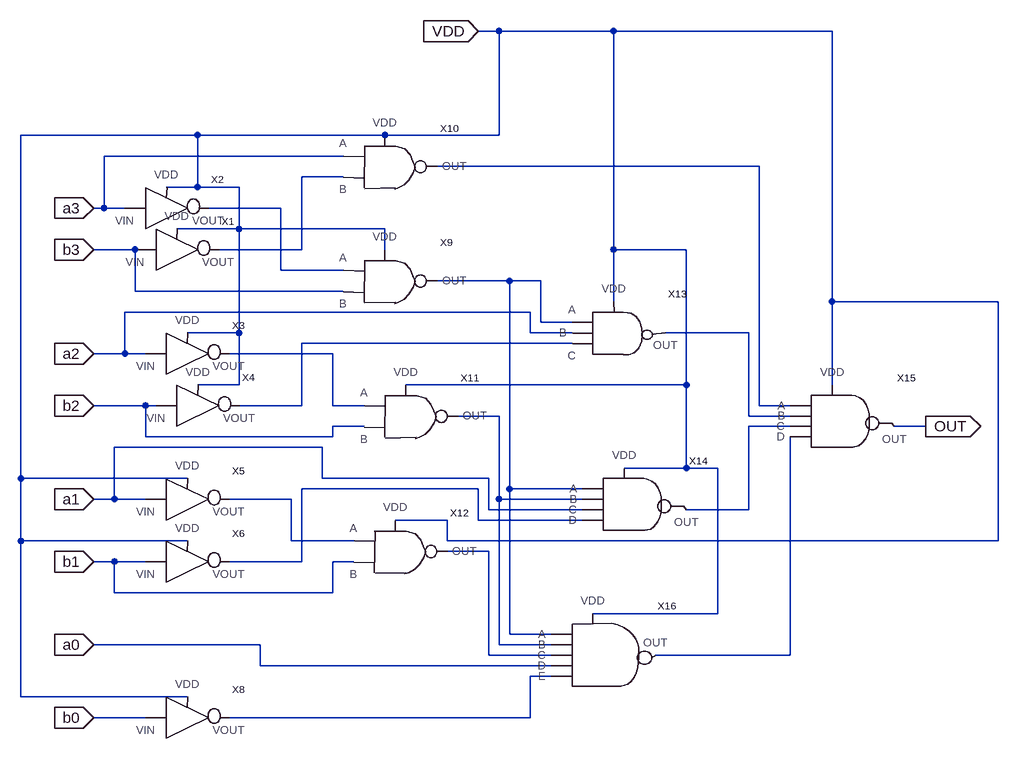
[diagram p0: schematic comparator.asc]
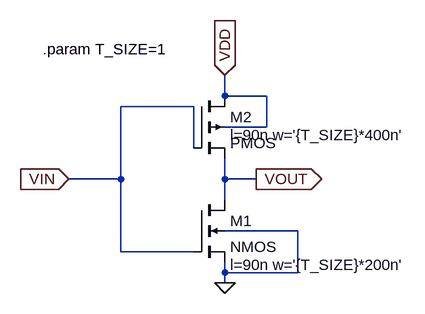
[diagram p1: sub-circuit inverter.asc]
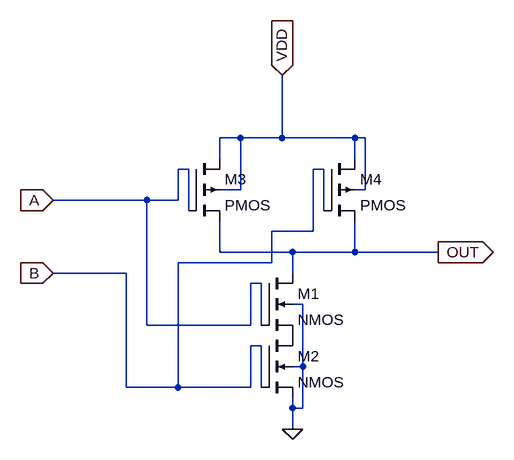
[diagram p2: sub-circuit nand.asc]
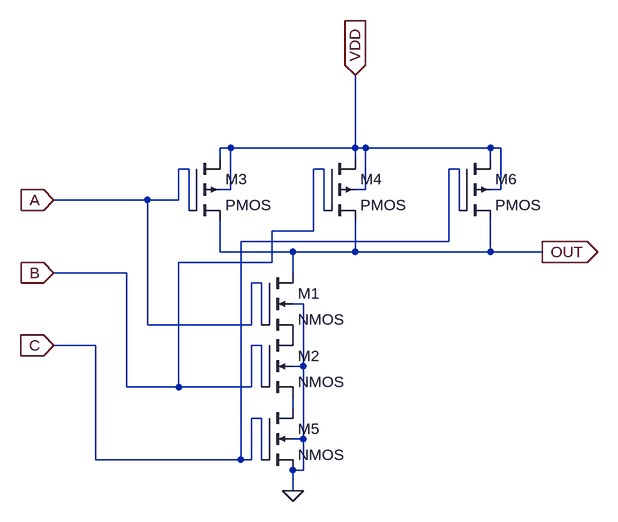
[diagram p3: sub-circuit nand3.asc]
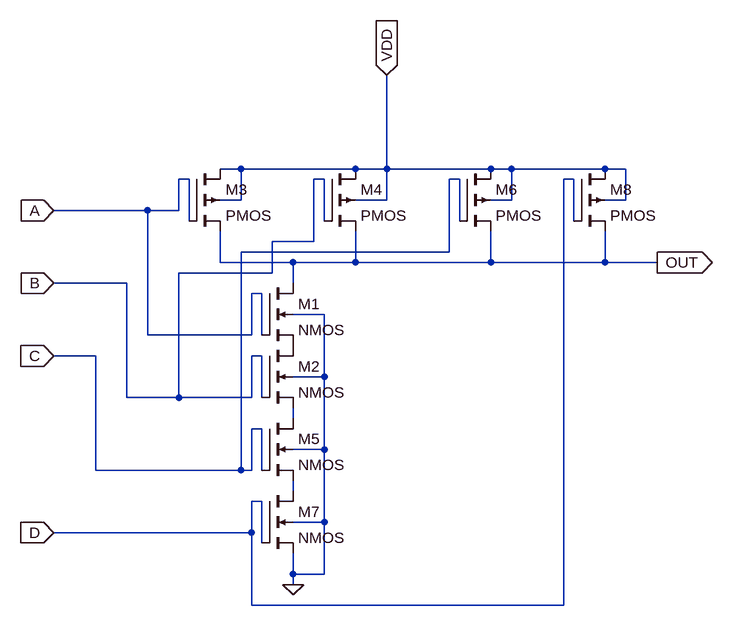
[diagram p4: sub-circuit nand4.asc]
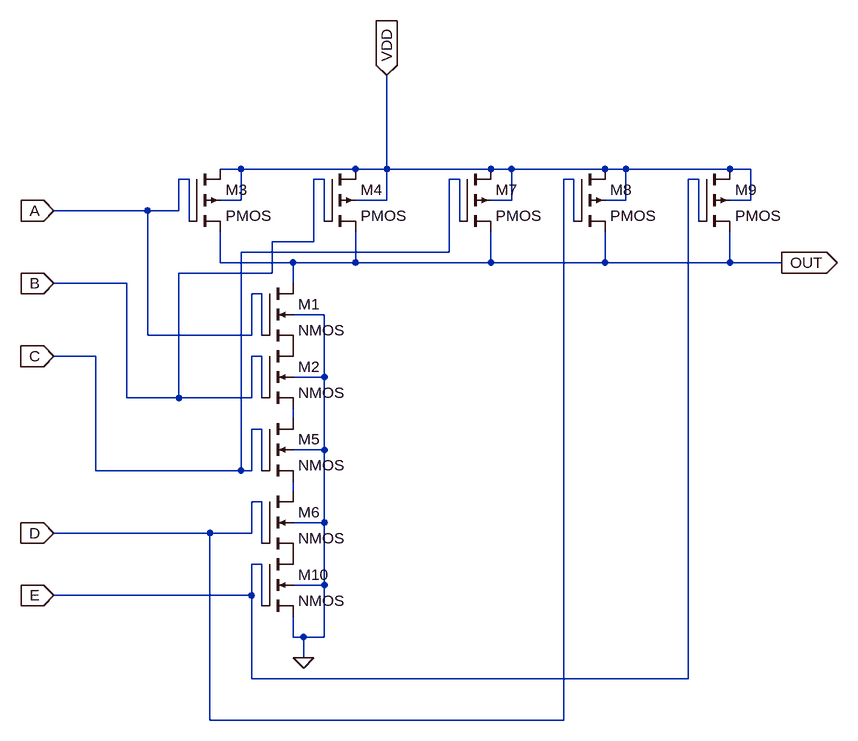
[diagram p5: sub-circuit nand5.asc]
comparator.asc, the LTspice schematic file:
Version 4
SHEET 1 1444 904
WIRE 672 -224 640 -224
WIRE 848 -224 672 -224
WIRE 1184 -224 848 -224
WIRE 208 -64 -64 -64
WIRE 496 -64 208 -64
WIRE 672 -64 672 -224
WIRE 672 -64 496 -64
WIRE 432 -32 64 -32
WIRE 1072 -16 576 -16
WIRE 432 0 368 0
WIRE 208 16 208 -64
WIRE 208 16 160 16
WIRE 272 16 208 16
WIRE 64 48 64 -32
WIRE 64 48 48 48
WIRE 96 48 64 48
WIRE 336 48 224 48
WIRE 272 80 272 16
WIRE 272 80 176 80
WIRE 496 80 272 80
WIRE 112 112 48 112
WIRE 368 112 368 0
WIRE 368 112 240 112
WIRE 496 112 496 80
WIRE 848 112 848 -224
WIRE 960 112 848 112
WIRE 336 144 336 48
WIRE 432 144 336 144
WIRE 688 160 576 160
WIRE 736 160 688 160
WIRE 112 176 112 112
WIRE 432 176 112 176
WIRE 848 192 848 112
WIRE 1184 192 1184 -224
WIRE 1440 192 1184 192
WIRE 720 208 96 208
WIRE 736 224 736 160
WIRE 784 224 736 224
WIRE 272 240 272 80
WIRE 272 240 192 240
WIRE 720 240 720 208
WIRE 784 240 720 240
WIRE 1056 240 928 240
WIRE 784 256 368 256
WIRE 96 272 96 208
WIRE 96 272 48 272
WIRE 128 272 96 272
WIRE 416 272 256 272
WIRE 272 320 272 240
WIRE 272 320 208 320
WIRE 960 320 960 112
WIRE 960 320 528 320
WIRE 1184 320 1184 192
WIRE 128 352 48 352
WIRE 144 352 128 352
WIRE 368 352 368 256
WIRE 368 352 272 352
WIRE 416 352 416 272
WIRE 464 352 416 352
WIRE 1072 352 1072 -16
WIRE 1120 352 1072 352
WIRE 672 368 608 368
WIRE 1056 368 1056 240
WIRE 1120 368 1056 368
WIRE 464 384 416 384
WIRE 1120 384 1056 384
WIRE 1328 384 1280 384
WIRE 128 400 128 352
WIRE 416 400 416 384
WIRE 416 400 128 400
WIRE 400 416 80 416
WIRE 960 448 960 320
WIRE 960 448 864 448
WIRE 1008 448 960 448
WIRE -64 464 -64 -64
WIRE 192 464 -64 464
WIRE 400 464 400 416
WIRE 656 464 400 464
WIRE 640 480 368 480
WIRE 688 480 688 160
WIRE 800 480 688 480
WIRE 80 496 80 416
WIRE 80 496 48 496
WIRE 128 496 80 496
WIRE 352 496 256 496
WIRE 672 496 672 368
WIRE 800 496 672 496
WIRE 656 512 656 464
WIRE 800 512 656 512
WIRE 1056 512 1056 384
WIRE 1056 512 960 512
WIRE 592 528 512 528
WIRE 640 528 640 480
WIRE 800 528 640 528
WIRE -64 560 -64 464
WIRE 192 560 -64 560
WIRE 352 560 352 496
WIRE 448 560 352 560
WIRE 592 560 592 528
WIRE 1440 560 1440 192
WIRE 1440 560 592 560
WIRE 656 576 592 576
WIRE 80 592 48 592
WIRE 128 592 80 592
WIRE 368 592 368 480
WIRE 368 592 256 592
WIRE 448 592 416 592
WIRE 80 640 80 592
WIRE 416 640 416 592
WIRE 416 640 80 640
WIRE 1008 672 1008 448
WIRE 1008 672 816 672
WIRE 688 704 688 480
WIRE 752 704 688 704
WIRE 304 720 48 720
WIRE 672 720 672 496
WIRE 752 720 672 720
WIRE 656 736 656 576
WIRE 752 736 656 736
WIRE 1120 736 1120 400
WIRE 1120 736 912 736
WIRE 304 752 304 720
WIRE 752 752 304 752
WIRE 752 768 720 768
WIRE -64 800 -64 560
WIRE 192 800 -64 800
WIRE 128 832 48 832
WIRE 720 832 720 768
WIRE 720 832 256 832
FLAG 48 48 a3
IOPIN 48 48 In
FLAG 48 112 b3
IOPIN 48 112 In
FLAG 48 272 a2
IOPIN 48 272 In
FLAG 48 352 b2
IOPIN 48 352 In
FLAG 48 496 a1
IOPIN 48 496 In
FLAG 48 592 b1
IOPIN 48 592 In
FLAG 48 720 a0
IOPIN 48 720 In
FLAG 48 832 b0
IOPIN 48 832 In
FLAG 1328 384 OUT
IOPIN 1328 384 Out
FLAG 640 -224 VDD
IOPIN 640 -224 In
SYMBOL inverter 176 112 R0
SYMATTR InstName X1
SYMBOL inverter 160 48 R0
SYMATTR InstName X2
SYMBOL inverter 192 272 R0
SYMATTR InstName X3
SYMBOL inverter 208 352 R0
SYMATTR InstName X4
SYMBOL inverter 192 496 R0
SYMATTR InstName X5
SYMBOL inverter 192 592 R0
SYMATTR InstName X6
SYMBOL inverter 192 832 R0
SYMATTR InstName X8
SYMBOL nand 496 160 R0
SYMATTR InstName X9
SYMBOL nand 496 -16 R0
SYMATTR InstName X10
SYMBOL nand 528 368 R0
SYMATTR InstName X11
SYMBOL nand 512 576 R0
SYMATTR InstName X12
SYMBOL nand3 832 240 R0
SYMATTR InstName X13
SYMBOL nand4 864 512 R0
SYMATTR InstName X14
SYMBOL nand4 1184 384 R0
SYMATTR InstName X15
SYMBOL nand5 800 752 R0
SYMATTR InstName X16

inverter.asc, the sub-circuit schematic file:
Version 4
SHEET 1 880 680
WIRE 176 -128 176 -160
WIRE 240 -128 176 -128
WIRE 128 -112 16 -112
WIRE 240 -80 240 -128
WIRE 240 -80 176 -80
WIRE 128 -48 128 -112
WIRE 16 0 16 -112
WIRE 16 0 -64 0
WIRE 176 0 176 -32
WIRE 224 0 176 0
WIRE 176 32 176 0
WIRE 288 80 176 80
WIRE 16 112 16 0
WIRE 128 112 16 112
WIRE 176 144 176 128
WIRE 288 144 288 80
WIRE 288 144 176 144
WIRE 176 160 176 144
FLAG 176 160 0
FLAG -64 0 VIN
IOPIN -64 0 In
FLAG 224 0 VOUT
IOPIN 224 0 Out
FLAG 176 -160 VDD
IOPIN 176 -160 In
SYMBOL nmos4 128 32 R0
WINDOW 123 56 100 Left 2
SYMATTR InstName M1
SYMATTR Value2 l=90n w='{T_SIZE}*200n'
SYMBOL pmos4 128 -128 R0
WINDOW 123 56 60 Left 2
SYMATTR InstName M2
SYMATTR Value2 l=90n w='{T_SIZE}*400n'
TEXT -104 -200 Left 2 !.param T_SIZE=1

nand.asc, the sub-circuit schematic file:
Version 4
SHEET 1 880 680
WIRE 144 -80 112 -80
WIRE 208 -80 208 -176
WIRE 208 -80 144 -80
WIRE 320 -80 208 -80
WIRE 336 -80 320 -80
WIRE 112 -48 112 -80
WIRE 320 -48 320 -80
WIRE 64 -32 48 -32
WIRE 272 -32 256 -32
WIRE 144 0 144 -80
WIRE 144 0 112 0
WIRE 336 0 336 -80
WIRE 336 0 320 0
WIRE 0 16 -144 16
WIRE 48 16 48 -32
WIRE 48 16 0 16
WIRE 64 32 64 -32
WIRE 272 32 272 -32
WIRE 256 64 256 -32
WIRE 256 64 192 64
WIRE 112 96 112 48
WIRE 224 96 112 96
WIRE 320 96 320 48
WIRE 320 96 224 96
WIRE 448 96 320 96
WIRE 192 112 192 64
WIRE 192 112 48 112
WIRE -32 128 -144 128
WIRE 224 128 224 96
WIRE 176 144 160 144
WIRE 240 176 224 176
WIRE 0 208 0 16
WIRE 160 208 160 144
WIRE 160 208 0 208
WIRE 176 208 176 144
WIRE 176 240 160 240
WIRE 240 272 240 176
WIRE 240 272 224 272
WIRE -32 304 -32 128
WIRE 48 304 48 112
WIRE 48 304 -32 304
WIRE 160 304 160 240
WIRE 160 304 48 304
WIRE 176 304 176 240
WIRE 224 336 224 320
WIRE 240 336 240 272
WIRE 240 336 224 336
WIRE 224 368 224 336
FLAG 224 368 0
FLAG 448 96 OUT
IOPIN 448 96 Out
FLAG -144 16 A
IOPIN -144 16 In
FLAG -144 128 B
IOPIN -144 128 In
FLAG 208 -176 VDD
IOPIN 208 -176 In
SYMBOL nmos4 176 128 R0
SYMATTR InstName M1
SYMATTR Value2 l=90n w=200n
SYMBOL nmos4 176 224 R0
SYMATTR InstName M2
SYMATTR Value2 l=90n w=200n
SYMBOL pmos4 64 -48 R0
SYMATTR InstName M3
SYMATTR Value2 l=90n w=400n
SYMBOL pmos4 272 -48 R0
SYMATTR InstName M4
SYMATTR Value2 l=90n w=400n

nand3.asc, the sub-circuit schematic file:
Version 4
SHEET 1 880 680
WIRE 96 32 80 32
WIRE 288 32 288 -80
WIRE 288 32 96 32
WIRE 304 32 288 32
WIRE 496 32 304 32
WIRE 512 32 496 32
WIRE 80 48 80 32
WIRE 288 48 288 32
WIRE 496 48 496 32
WIRE 32 64 16 64
WIRE 240 64 224 64
WIRE 448 64 432 64
WIRE 96 96 96 32
WIRE 96 96 80 96
WIRE 304 96 304 32
WIRE 304 96 288 96
WIRE 512 96 512 32
WIRE 512 96 496 96
WIRE -32 112 -176 112
WIRE 16 112 16 64
WIRE 16 112 -32 112
WIRE 32 128 32 64
WIRE 240 128 240 64
WIRE 448 128 448 64
WIRE 224 160 224 64
WIRE 224 160 160 160
WIRE 432 176 432 64
WIRE 432 176 112 176
WIRE 80 192 80 144
WIRE 192 192 80 192
WIRE 288 192 288 144
WIRE 288 192 192 192
WIRE 496 192 496 144
WIRE 496 192 288 192
WIRE 576 192 496 192
WIRE 160 208 160 160
WIRE 160 208 16 208
WIRE -64 224 -176 224
WIRE 192 224 192 192
WIRE 144 240 128 240
WIRE 208 272 192 272
WIRE -32 304 -32 112
WIRE 128 304 128 240
WIRE 128 304 -32 304
WIRE 144 304 144 240
WIRE -112 336 -176 336
WIRE 144 336 128 336
WIRE 208 368 208 272
WIRE 208 368 192 368
WIRE -64 400 -64 224
WIRE 16 400 16 208
WIRE 16 400 -64 400
WIRE 128 400 128 336
WIRE 128 400 16 400
WIRE 144 400 144 336
WIRE 192 432 192 416
WIRE 144 448 128 448
WIRE 208 480 208 368
WIRE 208 480 192 480
WIRE -112 512 -112 336
WIRE 112 512 112 176
WIRE 112 512 -112 512
WIRE 128 512 128 448
WIRE 128 512 112 512
WIRE 144 512 144 448
WIRE 208 528 208 480
WIRE 208 528 192 528
WIRE 192 560 192 528
FLAG -176 112 A
IOPIN -176 112 In
FLAG -176 224 B
IOPIN -176 224 In
FLAG 192 560 0
FLAG 576 192 OUT
IOPIN 576 192 Out
FLAG -176 336 C
IOPIN -176 336 In
FLAG 288 -80 VDD
IOPIN 288 -80 In
SYMBOL nmos4 144 224 R0
SYMATTR InstName M1
SYMATTR Value2 l=90n w=200n
SYMBOL nmos4 144 320 R0
SYMATTR InstName M2
SYMATTR Value2 l=90n w=200n
SYMBOL pmos4 32 48 R0
SYMATTR InstName M3
SYMATTR Value2 l=90n w=400n
SYMBOL pmos4 240 48 R0
SYMATTR InstName M4
SYMATTR Value2 l=90n w=400n
SYMBOL nmos4 144 432 R0
SYMATTR InstName M5
SYMATTR Value2 l=90n w=200n
SYMBOL pmos4 448 48 R0
SYMATTR InstName M6
SYMATTR Value2 l=90n w=400n

nand4.asc, the sub-circuit schematic file:
Version 4
SHEET 1 880 680
WIRE -48 -16 -80 -16
WIRE 128 -16 -48 -16
WIRE 176 -16 176 -160
WIRE 176 -16 128 -16
WIRE 336 -16 176 -16
WIRE 368 -16 336 -16
WIRE 512 -16 368 -16
WIRE 544 -16 512 -16
WIRE -128 0 -144 0
WIRE 80 0 64 0
WIRE 288 0 272 0
WIRE 464 0 448 0
WIRE -48 32 -48 -16
WIRE -48 32 -80 32
WIRE 176 32 176 -16
WIRE 176 32 128 32
WIRE 368 32 368 -16
WIRE 368 32 336 32
WIRE 544 32 544 -16
WIRE 544 32 512 32
WIRE -192 48 -336 48
WIRE -144 48 -144 0
WIRE -144 48 -192 48
WIRE -128 64 -128 0
WIRE 80 64 80 0
WIRE 288 64 288 0
WIRE 464 64 464 0
WIRE 64 96 64 0
WIRE 64 96 0 96
WIRE 272 112 272 0
WIRE 272 112 -48 112
WIRE -80 128 -80 80
WIRE 32 128 -80 128
WIRE 128 128 128 80
WIRE 128 128 32 128
WIRE 336 128 336 80
WIRE 336 128 128 128
WIRE 512 128 512 80
WIRE 512 128 336 128
WIRE 592 128 512 128
WIRE 0 144 0 96
WIRE 0 144 -144 144
WIRE -224 160 -336 160
WIRE 32 160 32 128
WIRE -16 176 -32 176
WIRE 80 208 32 208
WIRE -192 240 -192 48
WIRE -32 240 -32 176
WIRE -32 240 -192 240
WIRE -16 240 -16 176
WIRE -272 272 -336 272
WIRE -16 272 -32 272
WIRE 80 304 80 208
WIRE 80 304 32 304
WIRE -224 336 -224 160
WIRE -144 336 -144 144
WIRE -144 336 -224 336
WIRE -32 336 -32 272
WIRE -32 336 -144 336
WIRE -16 336 -16 272
WIRE 32 368 32 352
WIRE -16 384 -32 384
WIRE 80 416 80 304
WIRE 80 416 32 416
WIRE -272 448 -272 272
WIRE -48 448 -48 112
WIRE -48 448 -272 448
WIRE -32 448 -32 384
WIRE -32 448 -48 448
WIRE -16 448 -16 384
WIRE 32 480 32 464
WIRE -16 496 -32 496
WIRE 80 528 80 416
WIRE 80 528 32 528
WIRE -32 544 -32 496
WIRE -32 544 -336 544
WIRE -16 560 -16 496
WIRE 32 608 32 576
WIRE 80 608 80 528
WIRE 80 608 32 608
WIRE 32 624 32 608
WIRE -32 656 -32 544
WIRE 448 656 448 0
WIRE 448 656 -32 656
FLAG -336 48 A
IOPIN -336 48 In
FLAG -336 160 B
IOPIN -336 160 In
FLAG -336 272 C
IOPIN -336 272 In
FLAG 32 624 0
FLAG 592 128 OUT
IOPIN 592 128 Out
FLAG -336 544 D
IOPIN -336 544 In
FLAG 176 -160 VDD
IOPIN 176 -160 In
SYMBOL nmos4 -16 160 R0
SYMATTR InstName M1
SYMATTR Value2 l=90n w=200n
SYMBOL nmos4 -16 256 R0
SYMATTR InstName M2
SYMATTR Value2 l=90n w=200n
SYMBOL pmos4 -128 -16 R0
SYMATTR InstName M3
SYMATTR Value2 l=90n w=400n
SYMBOL pmos4 80 -16 R0
SYMATTR InstName M4
SYMATTR Value2 l=90n w=400n
SYMBOL nmos4 -16 368 R0
SYMATTR InstName M5
SYMATTR Value2 l=90n w=200n
SYMBOL nmos4 -16 480 R0
SYMATTR InstName M7
SYMATTR Value2 l=90n w=200n
SYMBOL pmos4 288 -16 R0
SYMATTR InstName M6
SYMATTR Value2 l=90n w=400n
SYMBOL pmos4 464 -16 R0
SYMATTR InstName M8
SYMATTR Value2 l=90n w=400n

nand5.asc, the sub-circuit schematic file:
Version 4
SHEET 1 880 788
WIRE -80 -64 -112 -64
WIRE 96 -64 -80 -64
WIRE 144 -64 144 -208
WIRE 144 -64 96 -64
WIRE 304 -64 144 -64
WIRE 336 -64 304 -64
WIRE 480 -64 336 -64
WIRE 512 -64 480 -64
WIRE 672 -64 512 -64
WIRE 704 -64 672 -64
WIRE -160 -48 -176 -48
WIRE 48 -48 32 -48
WIRE 256 -48 240 -48
WIRE 432 -48 416 -48
WIRE 624 -48 608 -48
WIRE -80 -16 -80 -64
WIRE -80 -16 -112 -16
WIRE 144 -16 144 -64
WIRE 144 -16 96 -16
WIRE 336 -16 336 -64
WIRE 336 -16 304 -16
WIRE 512 -16 512 -64
WIRE 512 -16 480 -16
WIRE 704 -16 704 -64
WIRE 704 -16 672 -16
WIRE -224 0 -368 0
WIRE -176 0 -176 -48
WIRE -176 0 -224 0
WIRE -160 16 -160 -48
WIRE 48 16 48 -48
WIRE 256 16 256 -48
WIRE 432 16 432 -48
WIRE 624 16 624 -48
WIRE 32 48 32 -48
WIRE 32 48 -32 48
WIRE 240 64 240 -48
WIRE 240 64 -80 64
WIRE -112 80 -112 32
WIRE 0 80 -112 80
WIRE 96 80 96 32
WIRE 96 80 0 80
WIRE 304 80 304 32
WIRE 304 80 96 80
WIRE 480 80 480 32
WIRE 480 80 304 80
WIRE 672 80 672 32
WIRE 672 80 480 80
WIRE 752 80 672 80
WIRE -32 96 -32 48
WIRE -32 96 -176 96
WIRE -256 112 -368 112
WIRE 0 112 0 80
WIRE -48 128 -64 128
WIRE 48 160 0 160
WIRE -224 192 -224 0
WIRE -64 192 -64 128
WIRE -64 192 -224 192
WIRE -48 192 -48 128
WIRE -304 224 -368 224
WIRE -48 224 -64 224
WIRE 48 256 48 160
WIRE 48 256 0 256
WIRE -256 288 -256 112
WIRE -176 288 -176 96
WIRE -176 288 -256 288
WIRE -64 288 -64 224
WIRE -64 288 -176 288
WIRE -48 288 -48 224
WIRE 0 320 0 304
WIRE -48 336 -64 336
WIRE 48 368 48 256
WIRE 48 368 0 368
WIRE -304 400 -304 224
WIRE -80 400 -80 64
WIRE -80 400 -304 400
WIRE -64 400 -64 336
WIRE -64 400 -80 400
WIRE -48 400 -48 336
WIRE 0 432 0 416
WIRE -48 448 -64 448
WIRE 48 480 48 368
WIRE 48 480 0 480
WIRE -128 496 -368 496
WIRE -64 496 -64 448
WIRE -64 496 -128 496
WIRE -48 512 -48 448
WIRE -48 544 -64 544
WIRE 48 576 48 480
WIRE 48 576 0 576
WIRE -64 592 -64 544
WIRE -64 592 -368 592
WIRE -48 608 -48 544
WIRE 0 656 0 624
WIRE 16 656 0 656
WIRE 48 656 48 576
WIRE 48 656 16 656
WIRE 16 688 16 656
WIRE -64 720 -64 592
WIRE 608 720 608 -48
WIRE 608 720 -64 720
WIRE -128 784 -128 496
WIRE 416 784 416 -48
WIRE 416 784 -128 784
FLAG -368 0 A
IOPIN -368 0 In
FLAG -368 112 B
IOPIN -368 112 In
FLAG -368 224 C
IOPIN -368 224 In
FLAG -368 496 D
IOPIN -368 496 In
FLAG 144 -208 VDD
IOPIN 144 -208 In
FLAG 752 80 OUT
IOPIN 752 80 Out
FLAG 16 688 0
FLAG -368 592 E
IOPIN -368 592 In
SYMBOL nmos4 -48 112 R0
SYMATTR InstName M1
SYMATTR Value2 l=90n w=200n
SYMBOL nmos4 -48 208 R0
SYMATTR InstName M2
SYMATTR Value2 l=90n w=200n
SYMBOL pmos4 -160 -64 R0
SYMATTR InstName M3
SYMATTR Value2 l=90n w=400n
SYMBOL pmos4 48 -64 R0
SYMATTR InstName M4
SYMATTR Value2 l=90n w=400n
SYMBOL nmos4 -48 320 R0
SYMATTR InstName M5
SYMATTR Value2 l=90n w=200n
SYMBOL nmos4 -48 432 R0
SYMATTR InstName M6
SYMATTR Value2 l=90n w=200n
SYMBOL pmos4 256 -64 R0
SYMATTR InstName M7
SYMATTR Value2 l=90n w=400n
SYMBOL pmos4 432 -64 R0
SYMATTR InstName M8
SYMATTR Value2 l=90n w=400n
SYMBOL pmos4 624 -64 R0
SYMATTR InstName M9
SYMATTR Value2 l=90n w=400n
SYMBOL nmos4 -48 528 R0
SYMATTR InstName M10
SYMATTR Value2 l=90n w=200n

The netlist it stands for:
* comparator.asc
XX1 b3 VDD N002 inverter
XX2 a3 VDD N003 inverter
XX3 a2 VDD N007 inverter
XX4 b2 VDD N006 inverter
XX5 a1 VDD N011 inverter
XX6 b1 VDD N010 inverter
XX8 b0 VDD N014 inverter
XX9 N003 b3 N004 VDD nand
XX10 a3 N002 N001 VDD nand
XX11 N007 b2 N008 VDD nand
XX12 N011 b1 N012 VDD nand
XX13 N004 a2 N006 VDD N005 nand3
XX14 N009 VDD N004 N008 a1 N010 nand4
XX15 OUT VDD N001 N005 N009 N013 nand4
XX16 N004 N008 N012 a0 N014 VDD N013 nand5

* block symbol definitions
.subckt inverter VIN VDD VOUT
M1 VOUT VIN 0 0 NMOS l=90n w='{T_SIZE}*200n'
M2 VDD VIN VOUT VDD PMOS l=90n w='{T_SIZE}*400n'
.param T_SIZE=1
.ends inverter

.subckt nand A B OUT VDD
M1 OUT A P001 0 NMOS l=90n w=200n
M2 P001 B 0 0 NMOS l=90n w=200n
M3 VDD A OUT VDD PMOS l=90n w=400n
M4 VDD B OUT VDD PMOS l=90n w=400n
.ends nand

.subckt nand3 A B C VDD OUT
M1 OUT A P001 0 NMOS l=90n w=200n
M2 P001 B N001 0 NMOS l=90n w=200n
M3 VDD A OUT VDD PMOS l=90n w=400n
M4 VDD B OUT VDD PMOS l=90n w=400n
M5 N001 C 0 0 NMOS l=90n w=200n
M6 VDD C OUT VDD PMOS l=90n w=400n
.ends nand3

.subckt nand4 OUT VDD A B C D
M1 OUT A P001 0 NMOS l=90n w=200n
M2 P001 B N001 0 NMOS l=90n w=200n
M3 VDD A OUT VDD PMOS l=90n w=400n
M4 VDD B OUT VDD PMOS l=90n w=400n
M5 N001 C N002 0 NMOS l=90n w=200n
M7 N002 D 0 0 NMOS l=90n w=200n
M6 VDD C OUT VDD PMOS l=90n w=400n
M8 VDD D OUT VDD PMOS l=90n w=400n
.ends nand4

.subckt nand5 A B C D E VDD OUT
M1 OUT A P001 0 NMOS l=90n w=200n
M2 P001 B N001 0 NMOS l=90n w=200n
M3 VDD A OUT VDD PMOS l=90n w=400n
M4 VDD B OUT VDD PMOS l=90n w=400n
M5 N001 C N002 0 NMOS l=90n w=200n
M6 N002 D P002 0 NMOS l=90n w=200n
M7 VDD C OUT VDD PMOS l=90n w=400n
M8 VDD D OUT VDD PMOS l=90n w=400n
M9 VDD E OUT VDD PMOS l=90n w=400n
M10 P002 E 0 0 NMOS l=90n w=200n
.ends nand5

.model NMOS NMOS
.model PMOS PMOS
.lib standard.mos
.backanno
.end